# EAGLE design X002B (EAGLE 6.6.0)
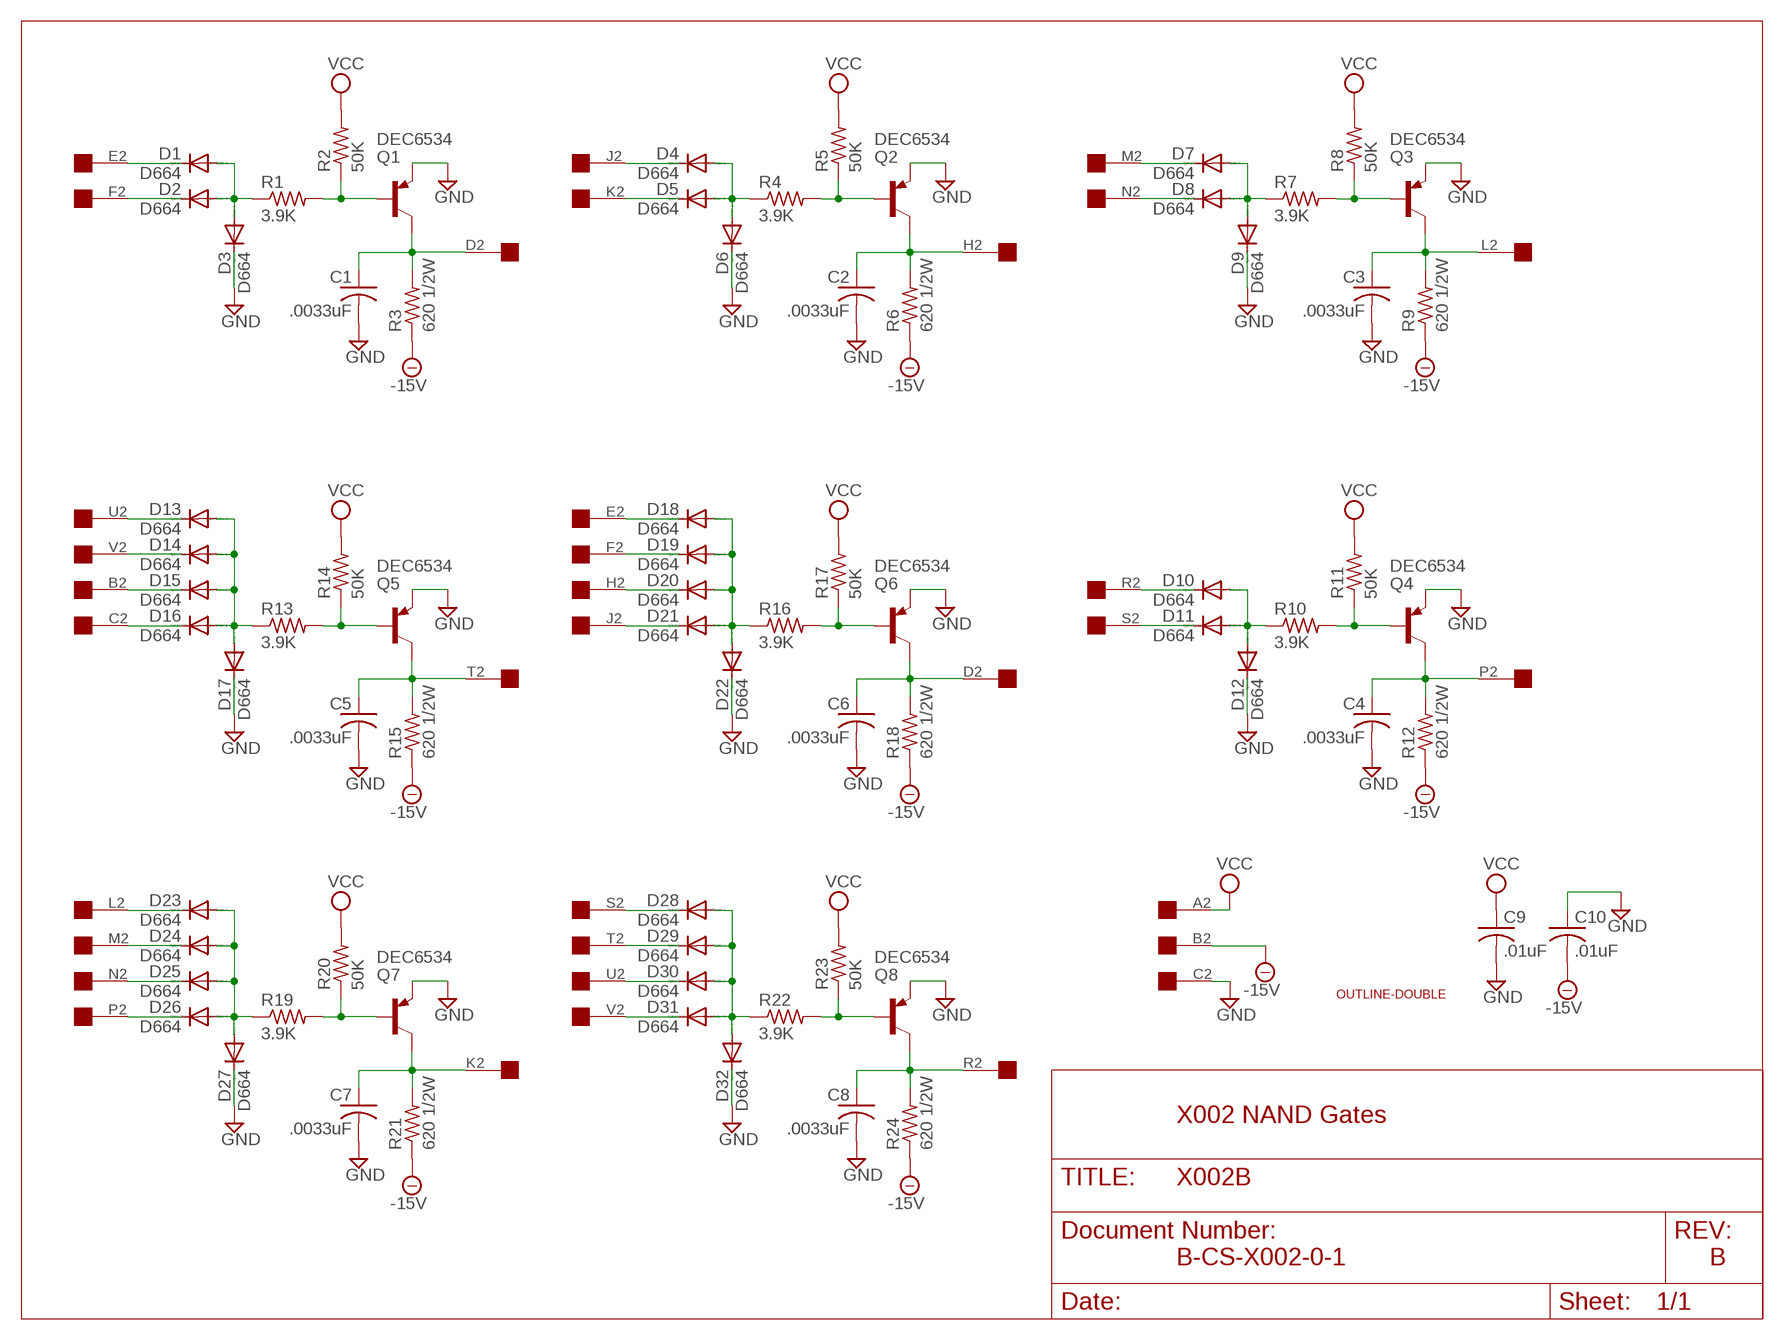
[diagram p0: schematic, sheet 1]

## Parts
A  EDGE-1  [EDGE-CON1]
B  EDGE-1  [EDGE-CON1]
C1  .0033uF  C-US225-062X268  [C225-062X268]
C2  .0033uF  C-US225-062X268  [C225-062X268]
C3  .0033uF  C-US225-062X268  [C225-062X268]
C4  .0033uF  C-US225-062X268  [C225-062X268]
C5  .0033uF  C-US225-062X268  [C225-062X268]
C6  .0033uF  C-US225-062X268  [C225-062X268]
C7  .0033uF  C-US225-062X268  [C225-062X268]
C8  .0033uF  C-US225-062X268  [C225-062X268]
C9  .01uF  C-US050-025X075  [C050-025X075]
C10  .01uF  C-US050-025X075  [C050-025X075]
D1  D664  DIODE-DO35-10  [DO35-10]
D2  D664  DIODE-DO35-10  [DO35-10]
D3  D664  DIODE-DO35-10  [DO35-10]
D4  D664  DIODE-DO35-10  [DO35-10]
D5  D664  DIODE-DO35-10  [DO35-10]
D6  D664  DIODE-DO35-10  [DO35-10]
D7  D664  DIODE-DO35-10  [DO35-10]
D8  D664  DIODE-DO35-10  [DO35-10]
D9  D664  DIODE-DO35-10  [DO35-10]
D10  D664  DIODE-DO35-10  [DO35-10]
D11  D664  DIODE-DO35-10  [DO35-10]
D12  D664  DIODE-DO35-10  [DO35-10]
D13  D664  DIODE-DO35-10  [DO35-10]
D14  D664  DIODE-DO35-10  [DO35-10]
D15  D664  DIODE-DO35-10  [DO35-10]
D16  D664  DIODE-DO35-10  [DO35-10]
D17  D664  DIODE-DO35-10  [DO35-10]
D18  D664  DIODE-DO35-10  [DO35-10]
D19  D664  DIODE-DO35-10  [DO35-10]
D20  D664  DIODE-DO35-10  [DO35-10]
D21  D664  DIODE-DO35-10  [DO35-10]
D22  D664  DIODE-DO35-10  [DO35-10]
D23  D664  DIODE-DO35-10  [DO35-10]
D24  D664  DIODE-DO35-10  [DO35-10]
D25  D664  DIODE-DO35-10  [DO35-10]
D26  D664  DIODE-DO35-10  [DO35-10]
D27  D664  DIODE-DO35-10  [DO35-10]
D28  D664  DIODE-DO35-10  [DO35-10]
D29  D664  DIODE-DO35-10  [DO35-10]
D30  D664  DIODE-DO35-10  [DO35-10]
D31  D664  DIODE-DO35-10  [DO35-10]
D32  D664  DIODE-DO35-10  [DO35-10]
Q1  DEC6534  -PNP-TO5  [TO5]
Q2  DEC6534  -PNP-TO5  [TO5]
Q3  DEC6534  -PNP-TO5  [TO5]
Q4  DEC6534  -PNP-TO5  [TO5]
Q5  DEC6534  -PNP-TO5  [TO5]
Q6  DEC6534  -PNP-TO5  [TO5]
Q7  DEC6534  -PNP-TO5  [TO5]
Q8  DEC6534  -PNP-TO5  [TO5]
R1  3.9K  R-US_0207/10  [0207/10]
R2  50K  R-US_0207/10  [0207/10]
R3  620 1/2W  R-US_0414/15  [0414/15]
R4  3.9K  R-US_0207/10  [0207/10]
R5  50K  R-US_0207/10  [0207/10]
R6  620 1/2W  R-US_0414/15  [0414/15]
R7  3.9K  R-US_0207/10  [0207/10]
R8  50K  R-US_0207/10  [0207/10]
R9  620 1/2W  R-US_0414/15  [0414/15]
R10  3.9K  R-US_0207/10  [0207/10]
R11  50K  R-US_0207/10  [0207/10]
R12  620 1/2W  R-US_0414/15  [0414/15]
R13  3.9K  R-US_0207/10  [0207/10]
R14  50K  R-US_0207/10  [0207/10]
R15  620 1/2W  R-US_0414/15  [0414/15]
R16  3.9K  R-US_0207/10  [0207/10]
R17  50K  R-US_0207/10  [0207/10]
R18  620 1/2W  R-US_0414/15  [0414/15]
R19  3.9K  R-US_0207/10  [0207/10]
R20  50K  R-US_0207/10  [0207/10]
R21  620 1/2W  R-US_0414/15  [0414/15]
R22  3.9K  R-US_0207/10  [0207/10]
R23  50K  R-US_0207/10  [0207/10]
R24  620 1/2W  R-US_0414/15  [0414/15]
U$1  OUTLINE-DOUBLE  [DOUBLE]

## Nets
-15V [Supply]: A.B2 C10.2 R3.1 R6.1 R9.1 R12.1 R15.1 R18.1 R21.1 R24.1
GND [Supply]: A.C2 C1.2 C2.2 C3.2 C4.2 C5.2 C6.2 C7.2 C8.2 C9.2 C10.1 D3.C D6.C D9.C D12.C D17.C D22.C D27.C D32.C Q1.1(E) Q2.1(E) Q3.1(E) Q4.1(E) Q5.1(E) Q6.1(E) Q7.1(E) Q8.1(E)
N$1: A.F2 D2.C
N$2: A.E2 D1.C
N$3: D1.A D2.A D3.A R1.1
N$4: Q1.2(B) R1.2 R2.1
N$5: A.D2 C1.1 Q1.3(C) R3.2
N$6: A.K2 D5.C
N$7: A.J2 D4.C
N$8: D4.A D5.A D6.A R4.1
N$9: Q2.2(B) R4.2 R5.1
N$10: A.H2 C2.1 Q2.3(C) R6.2
N$11: A.N2 D8.C
N$12: A.M2 D7.C
N$13: D7.A D8.A D9.A R7.1
N$14: Q3.2(B) R7.2 R8.1
N$15: A.L2 C3.1 Q3.3(C) R9.2
N$16: A.S2 D11.C
N$17: A.R2 D10.C
N$18: D10.A D11.A D12.A R10.1
N$19: Q4.2(B) R10.2 R11.1
N$20: A.P2 C4.1 Q4.3(C) R12.2
N$21: A.V2 D14.C
N$22: A.U2 D13.C
N$23: D13.A D14.A D15.A D16.A D17.A R13.1
N$24: Q5.2(B) R13.2 R14.1
N$25: A.T2 C5.1 Q5.3(C) R15.2
N$26: B.C2 D16.C
N$27: B.B2 D15.C
N$28: B.F2 D19.C
N$29: B.E2 D18.C
N$30: D18.A D19.A D20.A D21.A D22.A R16.1
N$31: Q6.2(B) R16.2 R17.1
N$32: B.D2 C6.1 Q6.3(C) R18.2
N$33: B.J2 D21.C
N$34: B.H2 D20.C
N$35: B.M2 D24.C
N$36: B.L2 D23.C
N$37: D23.A D24.A D25.A D26.A D27.A R19.1
N$38: Q7.2(B) R19.2 R20.1
N$39: B.K2 C7.1 Q7.3(C) R21.2
N$40: B.P2 D26.C
N$41: B.N2 D25.C
N$42: B.T2 D29.C
N$43: B.S2 D28.C
N$44: D28.A D29.A D30.A D31.A D32.A R22.1
N$45: Q8.2(B) R22.2 R23.1
N$46: B.R2 C8.1 Q8.3(C) R24.2
N$47: B.V2 D31.C
N$48: B.U2 D30.C
VCC [Supply]: A.A2 C9.1 R2.2 R5.2 R8.2 R11.2 R14.2 R17.2 R20.2 R23.2
Unconnected: B.A2

## Notes on the sheet
- X002 NAND Gates
- B-CS-X002-0-1 | B

## Library data of the parts
A B = dec-con:EDGE-1: Single-Sided DEC Edge Connector -- (side 2)
C1-C10 = rcl:C-US: CAPACITOR, American symbol
D1-D32 = diode:DIODE-: DIODE
Q1-Q8 = transistor:*-PNP-: PNP Transistror
R1-R24 = rcl:R-US_: RESISTOR, American symbol
U$1 = dec-con:OUTLINE-*: Board outlines for DEC boards.

## Net classes
1 Supply: width 0.813 mm

## Board
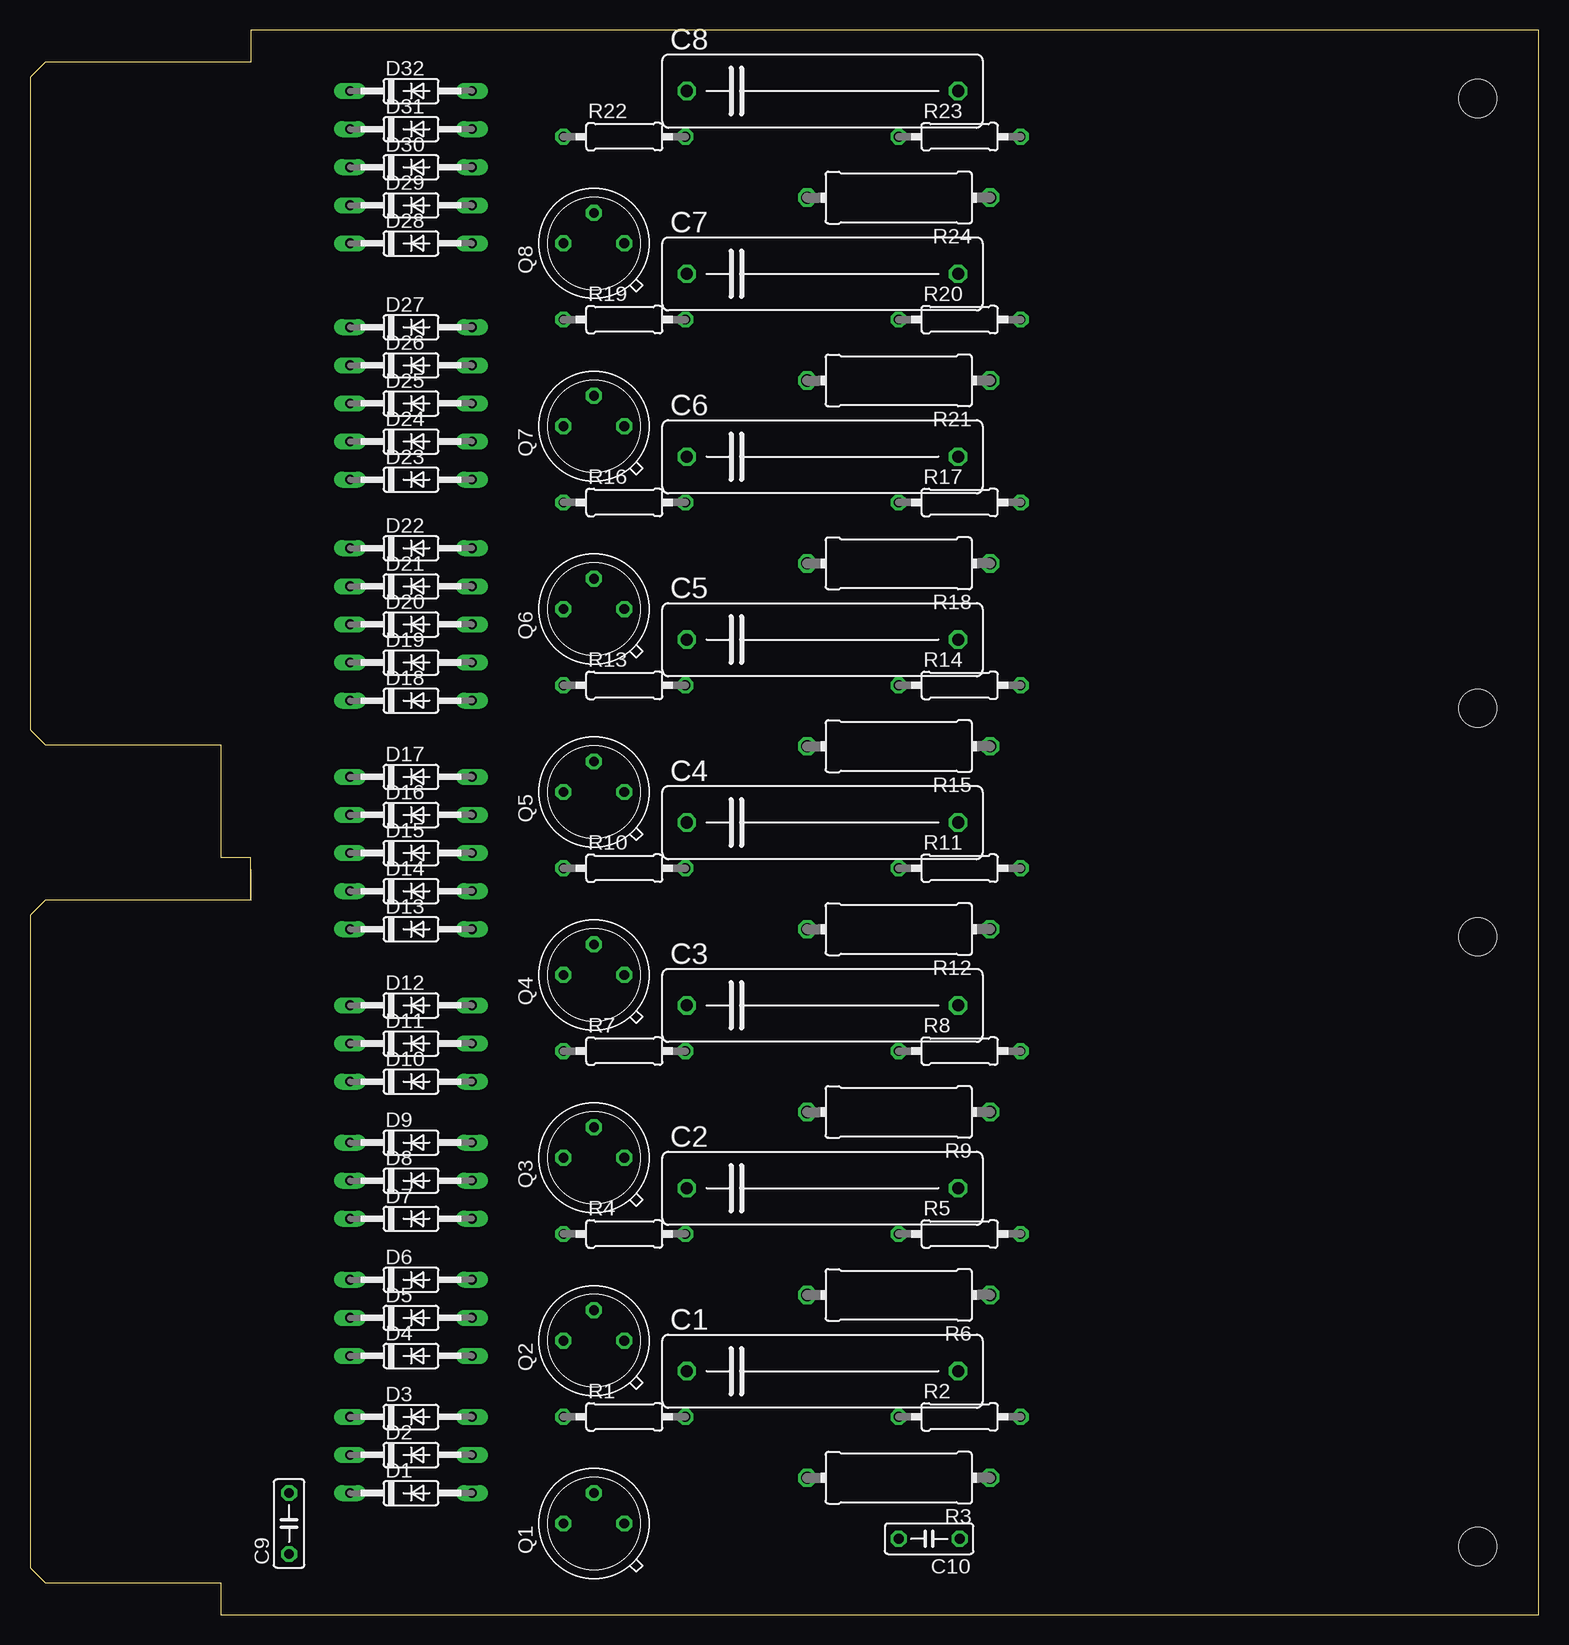
[diagram p1: board, top side]
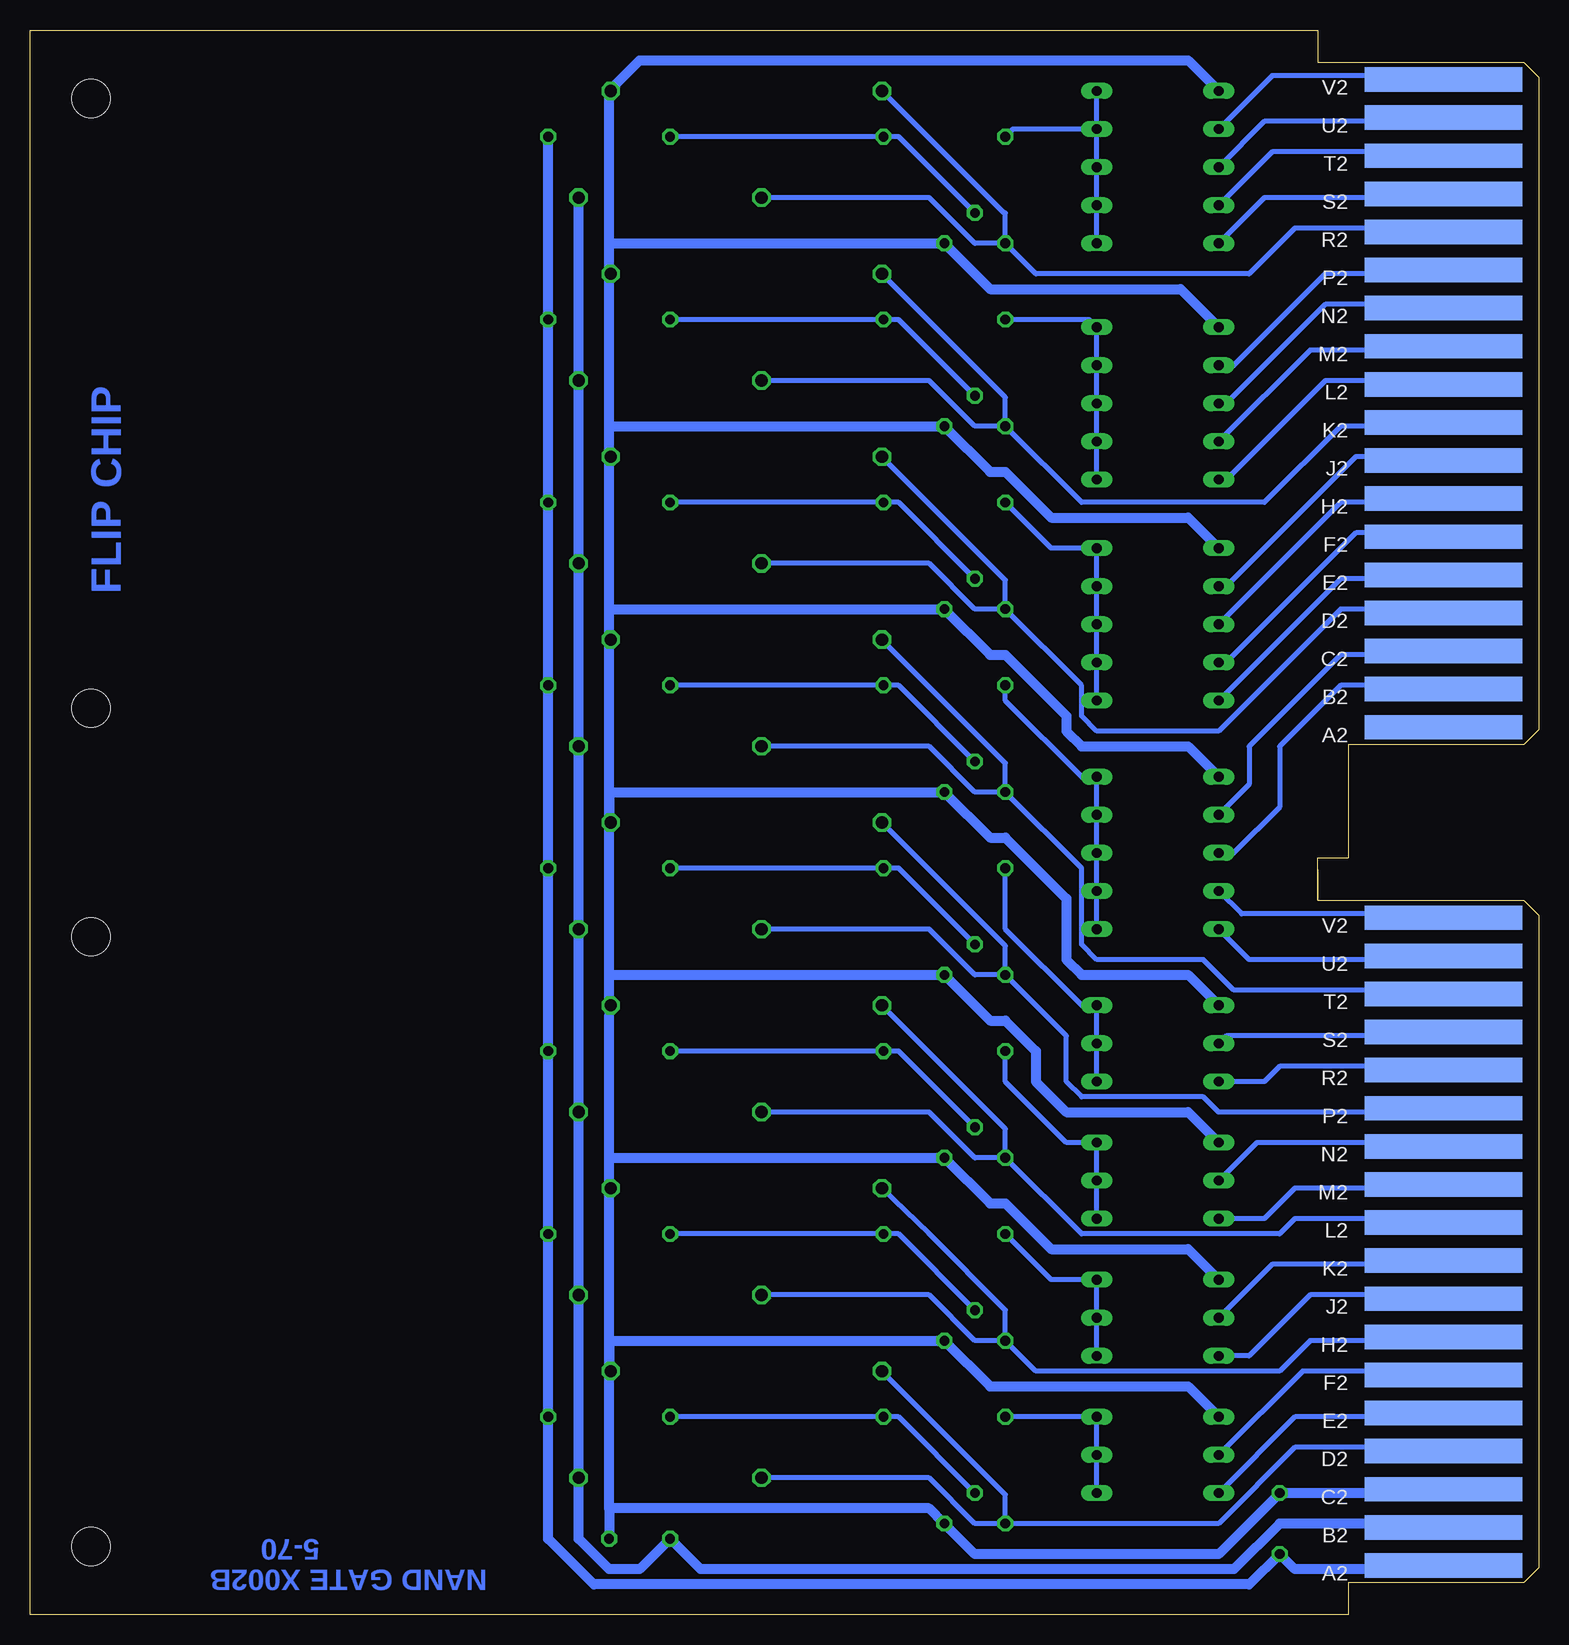
[diagram p2: board, bottom side, seen from below]

Size 125.73 x 132.08 mm. Coordinates in mm from the lower left corner, seen from the top.
Copper layers (1+16): Top 0.035mm / dielectric 1.5mm / Bottom 0.035mm
Design rules "16mils": minimum track width 16mil, minimum drill 32mil, track to track 15mil, track to pad 10mil, pad to pad 10mil, via to via 10mil, smd to smd 10mil, copper to edge 13mil, drill to drill 10mil, minimum pad ring 10mil, minimum via ring 8mil, stop-mask expansion 0mil, vias tented up to drill 0mil, thermal gap 10mil

### Footprints (pad centres in the part's own frame; a part is rotated, then mirrored left to right if it is on the bottom)
EDGE-CON1 = smd 13.106 x 2.032 bottom: A2 7.938,4.128; B2 7.938,7.303; C2 7.938,10.477; D2 7.938,13.652; E2 7.938,16.828; F2 7.938,20.003; H2 7.938,23.177; J2 7.938,26.352; K2 7.938,29.527; L2 7.938,32.703; M2 7.938,35.877; N2 7.938,39.053; P2 7.938,42.227; R2 7.938,45.403; S2 7.938,48.578; T2 7.938,51.752; U2 7.938,54.928; V2 7.938,58.102
C225-062X268 = drill 1.016 octagon: 1 -11.303,0; 2 11.303,0
C050-025X075 = drill 0.813 octagon: 1 -2.54,0; 2 2.54,0
DO35-10 = drill 0.813 long: A 5.08,0; C -5.08,0
TO5 = drill 0.813 octagon: 1 0,-2.54; 2 2.54,0; 3 0,2.54
0207/10 = drill 0.813 octagon: 1 -5.08,0; 2 5.08,0
0414/15 = drill 1.016 octagon: 1 -7.62,0; 2 7.62,0
DOUBLE = hole 3.175: 120.65,56.515; 120.65,5.715; 120.65,75.565; 120.65,126.365

### Placement (x,y rotation side)
A  0,0 0 top
B  0,69.85 0 top
C1  66.04,20.32 0 top
C2  66.04,35.56 0 top
C3  66.04,50.8 0 top
C4  66.04,66.04 0 top
C5  66.04,81.28 0 top
C6  66.04,96.52 0 top
C7  66.04,111.76 0 top
C8  66.04,127 0 top
C9  21.59,7.62 90 top
C10  74.93,6.35 180 top
D1  31.75,10.16 0 top
D2  31.75,13.34 0 top
D3  31.75,16.51 0 top
D4  31.75,21.59 0 top
D5  31.75,24.77 0 top
D6  31.75,27.94 0 top
D7  31.75,33.02 0 top
D8  31.75,36.2 0 top
D9  31.75,39.37 0 top
D10  31.75,44.45 0 top
D11  31.75,47.62 0 top
D12  31.75,50.8 0 top
D13  31.75,57.15 0 top
D14  31.75,60.33 0 top
D15  31.75,63.5 0 top
D16  31.75,66.67 0 top
D17  31.75,69.85 0 top
D18  31.75,76.2 0 top
D19  31.75,79.38 0 top
D20  31.75,82.55 0 top
D21  31.75,85.72 0 top
D22  31.75,88.9 0 top
D23  31.75,94.61 0 top
D24  31.75,97.79 0 top
D25  31.75,100.97 0 top
D26  31.75,104.14 0 top
D27  31.75,107.31 0 top
D28  31.75,114.3 0 top
D29  31.75,117.47 0 top
D30  31.75,120.65 0 top
D31  31.75,123.83 0 top
D32  31.75,127 0 top
Q1  46.99,7.62 90 top
Q2  46.99,22.86 90 top
Q3  46.99,38.1 90 top
Q4  46.99,53.34 90 top
Q5  46.99,68.58 90 top
Q6  46.99,83.82 90 top
Q7  46.99,99.06 90 top
Q8  46.99,114.3 90 top
R1  49.53,16.51 0 top
R2  77.47,16.51 0 top
R3  72.39,11.43 180 top
R4  49.53,31.75 0 top
R5  77.47,31.75 0 top
R6  72.39,26.67 180 top
R7  49.53,46.99 0 top
R8  77.47,46.99 0 top
R9  72.39,41.91 180 top
R10  49.53,62.23 0 top
R11  77.47,62.23 0 top
R12  72.39,57.15 180 top
R13  49.53,77.47 0 top
R14  77.47,77.47 0 top
R15  72.39,72.39 180 top
R16  49.53,92.71 0 top
R17  77.47,92.71 0 top
R18  72.39,87.63 180 top
R19  49.53,107.95 0 top
R20  77.47,107.95 0 top
R21  72.39,102.87 180 top
R22  49.53,123.19 0 top
R23  77.47,123.19 0 top
R24  72.39,118.11 180 top
U$1  0,0 0 top
U$2  [FLIPCHIP]  123.19,66.04 0 bottom

### Tracks (layer width: path | path; a pad name or v marks a point on that pad's centre or on a via)
-15V
  Bottom 0.813: A.B2 8.26,7.62 21.59,7.62 25.4,3.81 69.85,3.81 C10.2 74.93,3.81 77.47,3.81 80.01,6.35 R3.1 R6.1 R9.1 R12.1 R15.1 R18.1 R21.1 R24.1
GND
  Bottom 0.813: A.C2 8.26,10.16 C9.2 26.67,5.08 46.99,5.08 Q1.1 50.8,8.89 77.47,8.89 | 77.47,8.89 C10.1 | 77.41,20.26 77.47,20.19 77.47,8.89 | 77.41,20.26 C1.2 77.47,20.45 77.47,22.86 | D3.C 29.21,19.05 45.72,19.05 Q2.1 77.47,22.86 | D6.C 29.21,30.48 40.64,30.48 44.45,34.29 45.72,34.29 Q3.1 77.47,38.1 | D9.C 29.21,41.91 39.37,41.91 41.91,44.45 41.91,46.99 44.45,49.53 45.72,49.53 Q4.1 77.47,53.34 | D12.C 29.21,53.34 38.1,53.34 39.37,54.61 39.37,59.69 44.45,64.77 45.72,64.77 Q5.1 77.47,68.58 | D17.C 29.21,72.39 38.1,72.39 39.37,73.66 39.37,74.93 44.45,80.01 45.72,80.01 Q6.1 77.47,83.82 | D22.C 29.21,91.44 40.64,91.44 44.45,95.25 45.72,95.25 Q7.1 77.47,99.06 | D27.C 29.85,110.49 45.72,110.49 Q8.1 77.47,114.3 | D32.C 29.21,129.54 74.93,129.54 77.47,127 77.41,126.94 | 77.47,35.56 C2.2 | 77.47,22.86 77.47,35.56 | 77.41,50.74 77.47,49.4 77.47,38.1 | 77.41,50.74 C3.2 | 77.47,81.28 77.47,81.41 C5.2 | 77.47,68.58 77.47,66.17 C4.2 77.41,65.98 | 77.47,68.58 77.47,81.28 | 77.41,50.74 77.47,50.8 77.47,53.34 | 77.41,65.98 77.47,65.91 77.47,53.34 | 77.47,111.76 C7.2 | 77.41,126.94 77.47,126.87 77.47,114.3 | 77.41,126.94 C8.2 | 77.41,96.46 77.47,96.39 77.47,83.82 | 77.41,96.46 C6.2 | 77.41,96.46 77.47,96.52 77.47,99.06 | 77.47,99.06 77.47,111.76 | 77.47,111.76 77.47,114.3 | 77.47,81.28 77.47,83.82 | 77.47,35.56 77.47,38.1 | 77.41,65.98 77.47,66.04 77.47,68.58 | 77.41,20.26 77.47,20.32 77.47,22.86
N$1
  Bottom 0.406: D2.C 19.69,20.32 8.26,20.32 A.F2
N$2
  Bottom 0.406: A.E2 8.26,16.51 20.32,16.51 D1.C
N$3
  Bottom 0.406: R1.1 D3.A D2.A D1.A
N$4
  Bottom 0.406: Q1.2 53.34,16.51 R1.2 R2.1
N$5
  Bottom 0.406: A.D2 8.26,13.97 20.32,13.97 26.67,7.62 Q1.3 | C1.1 44.45,10.03 Q1.3 | R3.2 50.8,11.43 46.99,7.62 Q1.3
N$6
  Bottom 0.406: D5.C 22.23,29.21 8.26,29.21 A.K2
N$7
  Bottom 0.406: A.J2 8.26,26.67 19.05,26.67 24.13,21.59 D4.C
N$8
  Bottom 0.406: D4.A D5.A D6.A 40.64,27.94 R4.1
N$9
  Bottom 0.406: Q2.2 53.34,31.75 R4.2 R5.1
N$10
  Bottom 0.406: A.H2 8.26,22.86 19.05,22.86 21.59,20.32 41.91,20.32 Q2.3 | Q2.3 44.45,25.4 50.8,31.75 C2.1 | R6.2 50.8,26.67 46.99,22.86 Q2.3
N$11
  Bottom 0.406: D8.C 23.5,39.37 8.26,39.37 A.N2
N$12
  Bottom 0.406: A.M2 8.26,35.56 20.32,35.56 22.86,33.02 D7.C
N$13
  Bottom 0.406: D7.A D8.A D9.A 39.37,39.37 44.45,44.45 R7.1
N$14
  Bottom 0.406: R8.1 R7.2 53.34,46.99 Q3.2
N$15
  Bottom 0.406: A.L2 8.26,33.02 20.32,33.02 21.59,31.75 38.1,31.75 Q3.3 | R9.2 50.8,41.91 46.99,38.1 Q3.3 | C3.1 44.45,40.51 Q3.3
N$16
  Bottom 0.406: A.S2 8.26,48.26 26.04,48.26 D11.C
N$17
  Bottom 0.406: A.R2 8.26,45.72 21.59,45.72 22.86,44.45 D10.C
N$18
  Bottom 0.406: D10.A D11.A D12.A 38.1,50.8 44.45,57.15 R10.1
N$19
  Bottom 0.406: R11.1 R10.2 53.34,62.23 Q4.2
N$20
  Bottom 0.406: A.P2 8.26,41.91 26.67,41.91 27.94,43.18 38.1,43.18 39.37,44.45 39.37,48.26 Q4.3 | C4.1 44.45,55.75 Q4.3 | R12.2 50.8,57.15 46.99,53.34 Q4.3
N$21
  Bottom 0.406: A.V2 8.26,58.42 24.77,58.42 D14.C
N$22
  Bottom 0.406: A.U2 8.26,54.61 24.13,54.61 D13.C
N$23
  Bottom 0.406: D13.A D14.A D15.A D16.A D17.A 38.1,69.85 44.45,76.2 R13.1
N$24
  Bottom 0.406: Q5.2 53.34,77.47 R13.2 R14.1
N$25
  Bottom 0.406: A.T2 8.26,52.07 25.4,52.07 27.94,54.61 36.83,54.61 38.1,55.88 38.1,62.23 Q5.3 | R15.2 50.8,72.39 46.99,68.58 Q5.3 | C5.1 44.45,70.99 Q5.3
N$26
  Bottom 0.406: B.C2 8.26,80.01 16.51,80.01 24.13,72.39 24.13,69.22 D16.C
N$27
  Bottom 0.406: B.B2 8.26,77.47 16.51,77.47 21.59,72.39 21.59,67.31 25.4,63.5 D15.C
N$28
  Bottom 0.406: B.F2 8.26,90.17 15.24,90.17 26.04,79.38 D19.C
N$29
  Bottom 0.406: D18.C 16.51,86.36 8.26,86.36 B.E2
N$30
  Bottom 0.406: D18.A D19.A D20.A D21.A D22.A 40.64,88.9 R16.1
N$31
  Bottom 0.406: R17.1 R16.2 53.34,92.71 Q6.2
N$32
  Bottom 0.406: B.D2 8.26,83.82 16.51,83.82 26.67,73.66 36.83,73.66 38.1,74.93 38.1,77.47 Q6.3 | R18.2 50.8,87.63 46.99,83.82 Q6.3 | C6.1 44.45,86.23 Q6.3
N$33
  Bottom 0.406: B.J2 8.26,96.52 15.24,96.52 26.04,85.72 D21.C
N$34
  Bottom 0.406: B.H2 8.26,92.71 16.51,92.71 D20.C
N$35
  Bottom 0.406: B.M2 8.26,105.41 19.05,105.41 D24.C
N$36
  Bottom 0.406: B.L2 8.26,102.87 17.78,102.87 26.04,94.61 D23.C
N$37
  Bottom 0.406: R19.1 37.47,107.95 D27.A D26.A D25.A D24.A D23.A
N$38
  Bottom 0.406: R20.1 R19.2 53.34,107.95 Q7.2
N$39
  Bottom 0.406: B.K2 8.26,99.06 16.51,99.06 22.86,92.71 38.1,92.71 Q7.3 | C7.1 44.45,101.47 Q7.3 | R21.2 50.8,102.87 46.99,99.06 Q7.3
N$40
  Bottom 0.406: B.P2 8.26,111.76 17.78,111.76 25.4,104.14 D26.C
N$41
  Bottom 0.406: B.N2 8.26,109.22 17.78,109.22 26.04,100.97 D25.C
N$42
  Bottom 0.406: B.T2 8.26,121.92 22.23,121.92 D29.C
N$43
  Bottom 0.406: B.S2 8.26,118.11 22.86,118.11 D28.C
N$44
  Bottom 0.406: D31.A D32.A | D31.A D30.A D29.A D28.A | R22.1 43.82,123.83 D31.A
N$45
  Bottom 0.406: R23.1 R22.2 53.34,123.19 Q8.2
N$46
  Bottom 0.406: B.R2 8.26,115.57 20.32,115.57 24.13,111.76 41.91,111.76 Q8.3 | C8.1 44.58,116.84 44.45,116.84 Q8.3 | R24.2 50.8,118.11 46.99,114.3 Q8.3
N$47
  Bottom 0.406: B.V2 8.26,128.27 22.23,128.27 D31.C
N$48
  Bottom 0.406: B.U2 8.26,124.46 22.86,124.46 D30.C
VCC
  Bottom 0.813: A.A2 8.26,3.81 20.32,3.81 C9.1 24.13,2.54 78.74,2.54 82.55,6.35 R2.2 R5.2 R8.2 R11.2 R14.2 R17.2 R20.2 R23.2

### Text on the board
Bottom: 5-70 | NAND GATE X002B